# Altium project power.PrjPcb
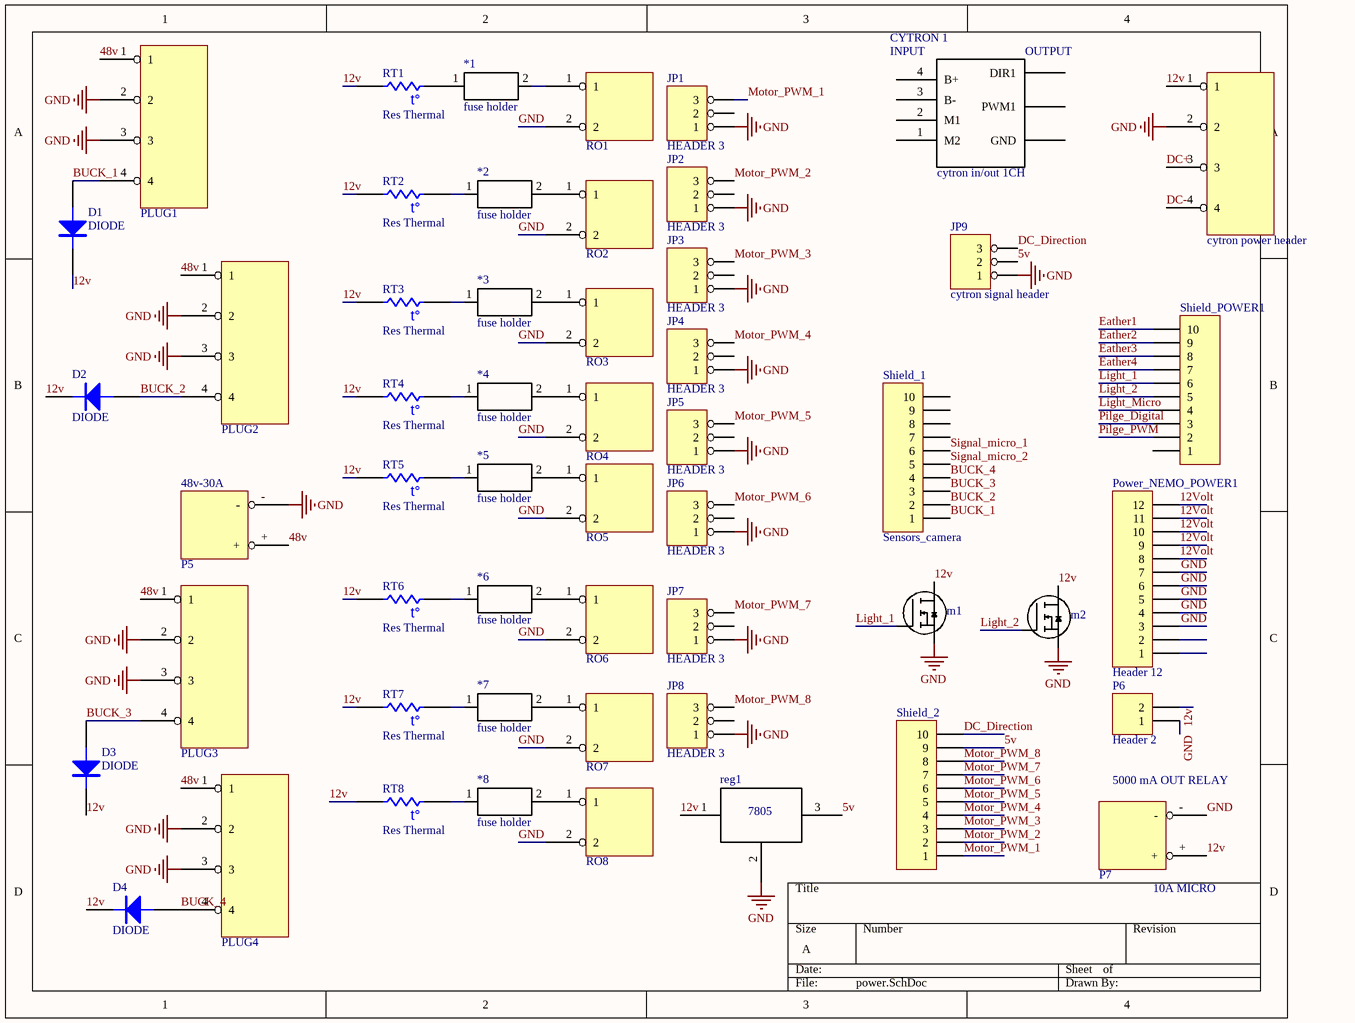
[diagram p0: power.SchDoc]
1 sheet, 53 parts. Net scope: global (net labels, ports and power ports of the same name join across sheets).
Board file: power.PcbDoc

## Sheet power.SchDoc
size A

### Parts
*1  fuse holder  [fuse Holder]
*2  fuse holder  [fuse Holder]
*3  fuse holder  [fuse Holder]
*4  fuse holder  [fuse Holder]
*5  fuse holder  [fuse Holder]
*6  fuse holder  [fuse Holder]
*7  fuse holder  [fuse Holder]
*8  fuse holder  [fuse Holder]
CYTRON_1  cytron in/out 1CH  [cytron in/out 1CH]
cytron_power_header  Rossetta 4-pin  [Rossetta 4-pin plugable]  (value not drawn)
D1  DIODE  [AXIAL0.3]
D2  DIODE  [AXIAL0.3]
D3  DIODE  [AXIAL0.3]
D4  DIODE  [AXIAL0.3]
JP1  HEADER 3  [SIP3]
JP2  HEADER 3  [SIP3]
JP3  HEADER 3  [SIP3]
JP4  HEADER 3  [SIP3]
JP5  HEADER 3  [SIP3]
JP6  HEADER 3  [SIP3]
JP7  HEADER 3  [SIP3]
JP8  HEADER 3  [SIP3]
JP9  cytron signal header  [SIP3]
m1  MOSFET  [TO252]  (value not drawn)
m2  MOSFET  [TO252]  (value not drawn)
P5  48v-30A  [XT-60]
P6  Header 2  [HDR1X2]
P7  XT-60  [XT-60]  (value not drawn)
PLUG1  Rossetta 4-pin  [Rossetta 4-pin plugable]  (value not drawn)
PLUG2  Rossetta 4-pin  [Rossetta 4-pin plugable]  (value not drawn)
PLUG3  Rossetta 4-pin  [Rossetta 4-pin plugable]  (value not drawn)
PLUG4  Rossetta 4-pin  [Rossetta 4-pin plugable]  (value not drawn)
Power_NEMO_POWER1  Header 12  [HDR1X12]
reg1  7805  [7805]  (value not drawn)
RO1  Rossetta  [Rossetta 2-pin]  (value not drawn)
RO2  Rossetta  [Rossetta 2-pin]  (value not drawn)
RO3  Rossetta  [Rossetta 2-pin]  (value not drawn)
RO4  Rossetta  [Rossetta 2-pin]  (value not drawn)
RO5  Rossetta  [Rossetta 2-pin]  (value not drawn)
RO6  Rossetta  [Rossetta 2-pin]  (value not drawn)
RO7  Rossetta  [Rossetta 2-pin]  (value not drawn)
RO8  Rossetta  [Rossetta 2-pin]  (value not drawn)
RT1  Res Thermal  [6-0805_N]
RT2  Res Thermal  [6-0805_N]
RT3  Res Thermal  [6-0805_N]
RT4  Res Thermal  [6-0805_N]
RT5  Res Thermal  [6-0805_N]
RT6  Res Thermal  [6-0805_N]
RT7  Res Thermal  [6-0805_N]
RT8  Res Thermal  [6-0805_N]
Shield_1  Sensors_camera  [HDR1X10]
Shield_2  Header 10  [HDR1X10]  (value not drawn)
Shield_POWER1  Header 10  [HDR1X10]  (value not drawn)

### Nets
GND: cytron_power_header.2 JP1.1 JP2.1 JP3.1 JP4.1 JP5.1 JP6.1 JP7.1 JP8.1 JP9.1 m1.S m2.S P5.- P6.1 P7.- PLUG1.2 PLUG1.3 PLUG2.2 PLUG2.3 PLUG3.2 PLUG3.3 PLUG4.2 PLUG4.3 Power_NEMO_POWER1.3 Power_NEMO_POWER1.4 Power_NEMO_POWER1.5 Power_NEMO_POWER1.6 Power_NEMO_POWER1.7 reg1.2(gnd) RO1.2 RO2.2 RO3.2 RO4.2 RO5.2 RO6.2 RO7.2 RO8.2
5v: JP9.2 reg1.3(v_out) Shield_2.9
12v: cytron_power_header.1 D1.2(K) D2.2(K) D3.2(K) D4.2(K) m1.D m2.D P6.2 P7.+ reg1.1(v_in) RT1.2 RT2.2 RT3.2 RT4.2 RT5.2 RT6.2 RT7.2 RT8.2
12Volt: Power_NEMO_POWER1.8 Power_NEMO_POWER1.9 Power_NEMO_POWER1.10 Power_NEMO_POWER1.11 Power_NEMO_POWER1.12
48v: P5.+ PLUG1.1 PLUG2.1 PLUG3.1 PLUG4.1
BUCK_1: D1.1(A) PLUG1.4 Shield_1.1
BUCK_2: D2.1(A) PLUG2.4 Shield_1.2
BUCK_3: D3.1(A) PLUG3.4 Shield_1.3
BUCK_4: D4.1(A) PLUG4.4 Shield_1.4
DC+: cytron_power_header.3
DC-: cytron_power_header.4
DC_Direction: JP9.3 Shield_2.10
Eather1: Shield_POWER1.10
Eather2: Shield_POWER1.9
Eather3: Shield_POWER1.8
Eather4: Shield_POWER1.7
Light_1: m1.G Shield_POWER1.6
Light_2: m2.G Shield_POWER1.5
Light_Micro: Shield_POWER1.4
Motor_PWM_1: JP1.3 Shield_2.1
Motor_PWM_2: JP2.3 Shield_2.2
Motor_PWM_3: JP3.3 Shield_2.3
Motor_PWM_4: JP4.3 Shield_2.4
Motor_PWM_5: JP5.3 Shield_2.5
Motor_PWM_6: JP6.3 Shield_2.6
Motor_PWM_7: JP7.3 Shield_2.7
Motor_PWM_8: JP8.3 Shield_2.8
Pilge_Digital: Shield_POWER1.3
Pilge_PWM: Shield_POWER1.2
Signal_micro_1: Shield_1.6
Signal_micro_2: Shield_1.5
Net*1_1: *1.1 RT1.1
Net*1_2: *1.2 RO1.1
Net*2_1: *2.1 RT2.1
Net*2_2: *2.2 RO2.1
Net*3_1: *3.1 RT3.1
Net*3_2: *3.2 RO3.1
Net*4_1: *4.1 RT4.1
Net*4_2: *4.2 RO4.1
Net*5_1: *5.1 RT5.1
Net*5_2: *5.2 RO5.1
Net*6_1: *6.1 RT6.1
Net*6_2: *6.2 RO6.1
Net*7_1: *7.1 RT7.1
Net*7_2: *7.2 RO7.1
Net*8_1: *8.1 RT8.1
Net*8_2: *8.2 RO8.1

Not connected (* = marked no-connect by the designer): CYTRON_1 1(M2) 2(M1) 3(B-) 4(B+) 5(DIR1) 6(PWM1) 7(GND); JP1 2; JP2 2; JP3 2; JP4 2; JP5 2; JP6 2; JP7 2; JP8 2; Power_NEMO_POWER1 1 2; Shield_1 7 8 9 10; Shield_POWER1 1

### Notes on the sheet
- (near P7) 5000 mA OUT RELAY
- (near P7) 10A MICRO
- (in symbol cytron in/out 1CH) INPUT; OUTPUT
- (in symbol Res Thermal) t°

### Library data of the parts
JP9 = HEADER 3
m1 m2 = MOSFET   AP9997AGH: STORE: https://semtronics.net/shop/index.php?rt=product/product&path=84_85_127_129&product_id=579; DATASHEET: http://pdf.tixer.ru/115463.pdf
P5 P7 = XT-60: XT-60 Connector
P6 = Header 2: Header, 2-Pin; LatestRevisionDate: 17-Jul-2002; LatestRevisionNote: Re-released for DXP Platform.; Publisher: Altium Limited
Power_NEMO_POWER1 = Header 12: Header, 12-Pin; LatestRevisionDate: 17-Jul-2002; LatestRevisionNote: Re-released for DXP Platform.; Publisher: Altium Limited
RT1-RT8 = Res Thermal: Thermistor; Published: 24-Mar-1999; LatestRevisionDate: 29-May-2009; LatestRevisionNote: IPC-7351 Footprint Added.; PackageVersion: Mar-2003; PackageReference: 6-0805; Publisher: Altium Limited; PackageDescription: Chip Resistor 0805 Case Size; Code_IPC: RESC2012
Shield_1 Shield_2 Shield_POWER1 = Header 10: Header, 10-Pin; LatestRevisionDate: 17-Jul-2002; LatestRevisionNote: Re-released for DXP Platform.; Publisher: Altium Limited
cytron_power_header PLUG1-PLUG4 = Rossetta 4-pin: Created By: NourAldin